# Altium schematic sheet RXTX_IF_3.SchDoc
size A
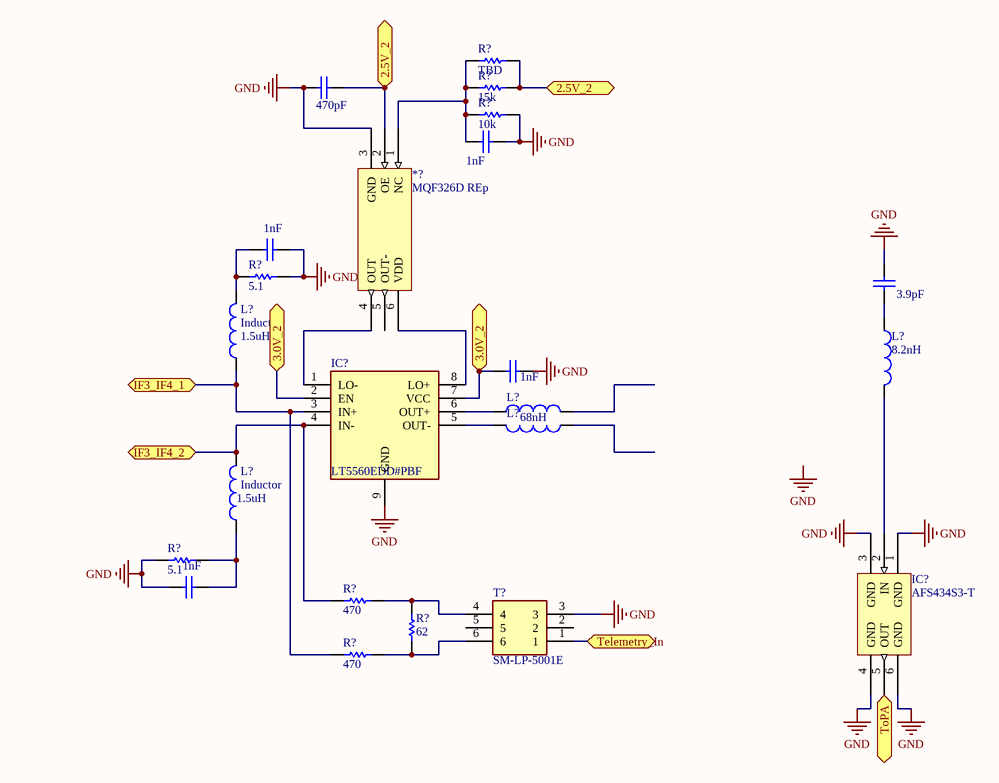
[diagram p0: RXTX_IF_3.SchDoc]

## Parts
(Parts that share a designator on the sheet are numbered #1, #2 ... from top to bottom, then left to right.)
*?  MQF326D REp  [MQF326D]
C?#1  value 470pF  [0603]  (hidden comment: Cap)
C?#2  value 1nF  [0603]  (hidden comment: Cap)
C?#3  value 1nF  [0603]  (hidden comment: Cap)
C?#4  value 3.9pF  [0603]  (hidden comment: Cap)
C?#5  value 1nF  [0603]  (hidden comment: Cap)
C?#6  value 1nF  [0603]  (hidden comment: Cap)
IC?#1  LT5560EDD#PBF  [SON50P300X300X80-9N-D]
IC?#2  AFS434S3-T  [AFS434S3]
L?#1  value 8.2nH  [0603]  (hidden comment: Inductor)
L?#2  Inductor  value 1.5uH  [0603]
L?#3  value 68nH  [0603]  (hidden comment: Inductor)
L?#4  Inductor  [0603]  (value not drawn)
L?#5  Inductor  value 1.5uH  [0603]
R?#1  value TBD  [0603]  (hidden comment: Res1)
R?#2  value 15k  [0603]  (hidden comment: Res1)
R?#3  value 10k  [0603]  (hidden comment: Res1)
R?#4  value 5.1  [0603]  (hidden comment: Res1)
R?#5  value 5.1  [0603]  (hidden comment: Res1)
R?#6  value 470  [0603]  (hidden comment: Res1)
R?#7  value 62  [0603]  (hidden comment: Res1)
R?#8  value 470  [0603]  (hidden comment: Res1)
T?  SM-LP-5001E  [SMLP5001E]

## Ports
2.5V_2 (bidir), 3.0V_2 (bidir), IF3_IF4_1 (bidir), IF3_IF4_2 (bidir), Telemetry_In (bidir), ToPA (bidir)

## Nets
GND: *?.3(GND) C?#1.1 C?#2.1 C?#3.1 C?#4.1 C?#5.1 C?#6.2 IC?#1.9(GND) IC?#2.1(GND) IC?#2.3(GND) IC?#2.4(GND) IC?#2.6(GND) R?#3.1 R?#4.1 R?#5.2 T?.3
2.5V_2: *?.2(OE) C?#1.2 R?#1.1 R?#2.1 ; port 2.5V_2
3.0V_2: C?#5.2 IC?#1.2(EN) IC?#1.7(VCC) ; port 3.0V_2
IF3_IF4_1: IC?#1.3(IN+) L?#2.1 R?#8.2 ; port IF3_IF4_1
IF3_IF4_2: IC?#1.4(IN-) L?#5.2 R?#6.2 ; port IF3_IF4_2
Telemetry_In: T?.1 ; port Telemetry_In
ToPA: IC?#2.5(OUT) ; port ToPA
Net*?_1: *?.1(NC) C?#2.2 R?#1.2 R?#2.2 R?#3.2
Net*?_4: *?.4(OUT) IC?#1.1(LO-)
Net*?_6: *?.6(VDD) IC?#1.8(LO+)
NetC?#3_2: C?#3.2 L?#2.2 R?#4.2
NetC?#4_2: C?#4.2 L?#1.1
NetC?#6_1: C?#6.1 L?#5.1 R?#5.1
NetIC?#1_5: IC?#1.5(OUT-) L?#4.2
NetIC?#1_6: IC?#1.6(OUT+) L?#3.1
NetIC?#2_2: IC?#2.2(IN) L?#1.2
NetR?#6_1: R?#6.1 R?#7.1 T?.4
NetR?#7_2: R?#7.2 R?#8.1 T?.6

Not connected (* = marked no-connect by the designer): *? 5(OUT-); L?#3 2; L?#4 1; T? 2 5

## Notes on the sheet
- Labels drawn without touching a wire or pin: GND

## Library data of the parts
*? IC?#2 = Component_1
C?#1-C?#6 = Cap: Capacitor; Published: 8-Jun-2000; LatestRevisionDate: 17-Jul-2002; LatestRevisionNote: Re-released for DXP Platform.; PackageReference: RAD-0.3; Publisher: Altium Limited; PackageDescription: Radial Cap, Thru-Hole; 2 Leads; 0.3 in Pin Spacing
IC?#1 = LT5560EDD#PBF: Integrated Circuit; Manufacturer_Name: Linear Technology; Datasheet Link: https://www.analog.com/media/en/technical-documentation/data-sheets/5560f.pdf; Height: 0.8mm; Manufacturer_Part_Number: LT5560EDD#PBF; Mouser Part Number: 584-LT5560EDD#PBF; Mouser Price/Stock: https://www.mouser.com/Search/Refine.aspx?Keyword=584-LT5560EDD%23PBF; RS Part Number: 7869705; RS Price/Stock: https://uk.rs-online.com/web/p/products/7869705
L?#1-L?#5 = Inductor: Code_IEC: 1005; Published: 8-Jun-2000; LatestRevisionDate: 29-May-2009; LatestRevisionNote: IPC-7351 Footprint Added.; PackageReference: 0402-A; Publisher: Altium Limited; PackageDescription: Chip Inductor; Code_JEITA: 0402
R?#1-R?#8 = Res1: Resistor; Published: 8-Jun-2000; LatestRevisionDate: 17-Jul-2002; LatestRevisionNote: Re-released for DXP Platform.; PackageReference: AXIAL-0.3; Publisher: Altium Limited; PackageDescription: Axial Device, Thru-Hole; 2 Leads; 0.3 in Pin Spacing
T? = SM-LP-5001E: 1:1 Transformer; Manufacturer_Name: Bourns; Allied_Number: 70155232; Datasheet Link: https://www.bourns.com/pdfs/SMLP5001.pdf; Height: 7mm; Manufacturer_Part_Number: SM-LP-5001E; Mouser Part Number: 652-SM-LP-5001E; Mouser Price/Stock: https://www.mouser.com/Search/Refine.aspx?Keyword=652-SM-LP-5001E; RS Part Number: 1728670; RS Price/Stock: https://uk.rs-online.com/web/p/products/1728670; Allied Price/Stock: https://www.alliedelec.com/bourns-sm-lp-5001e/70155232/